# Altium project POWER_SUPPLY.PrjPcb (part 6 of 8)
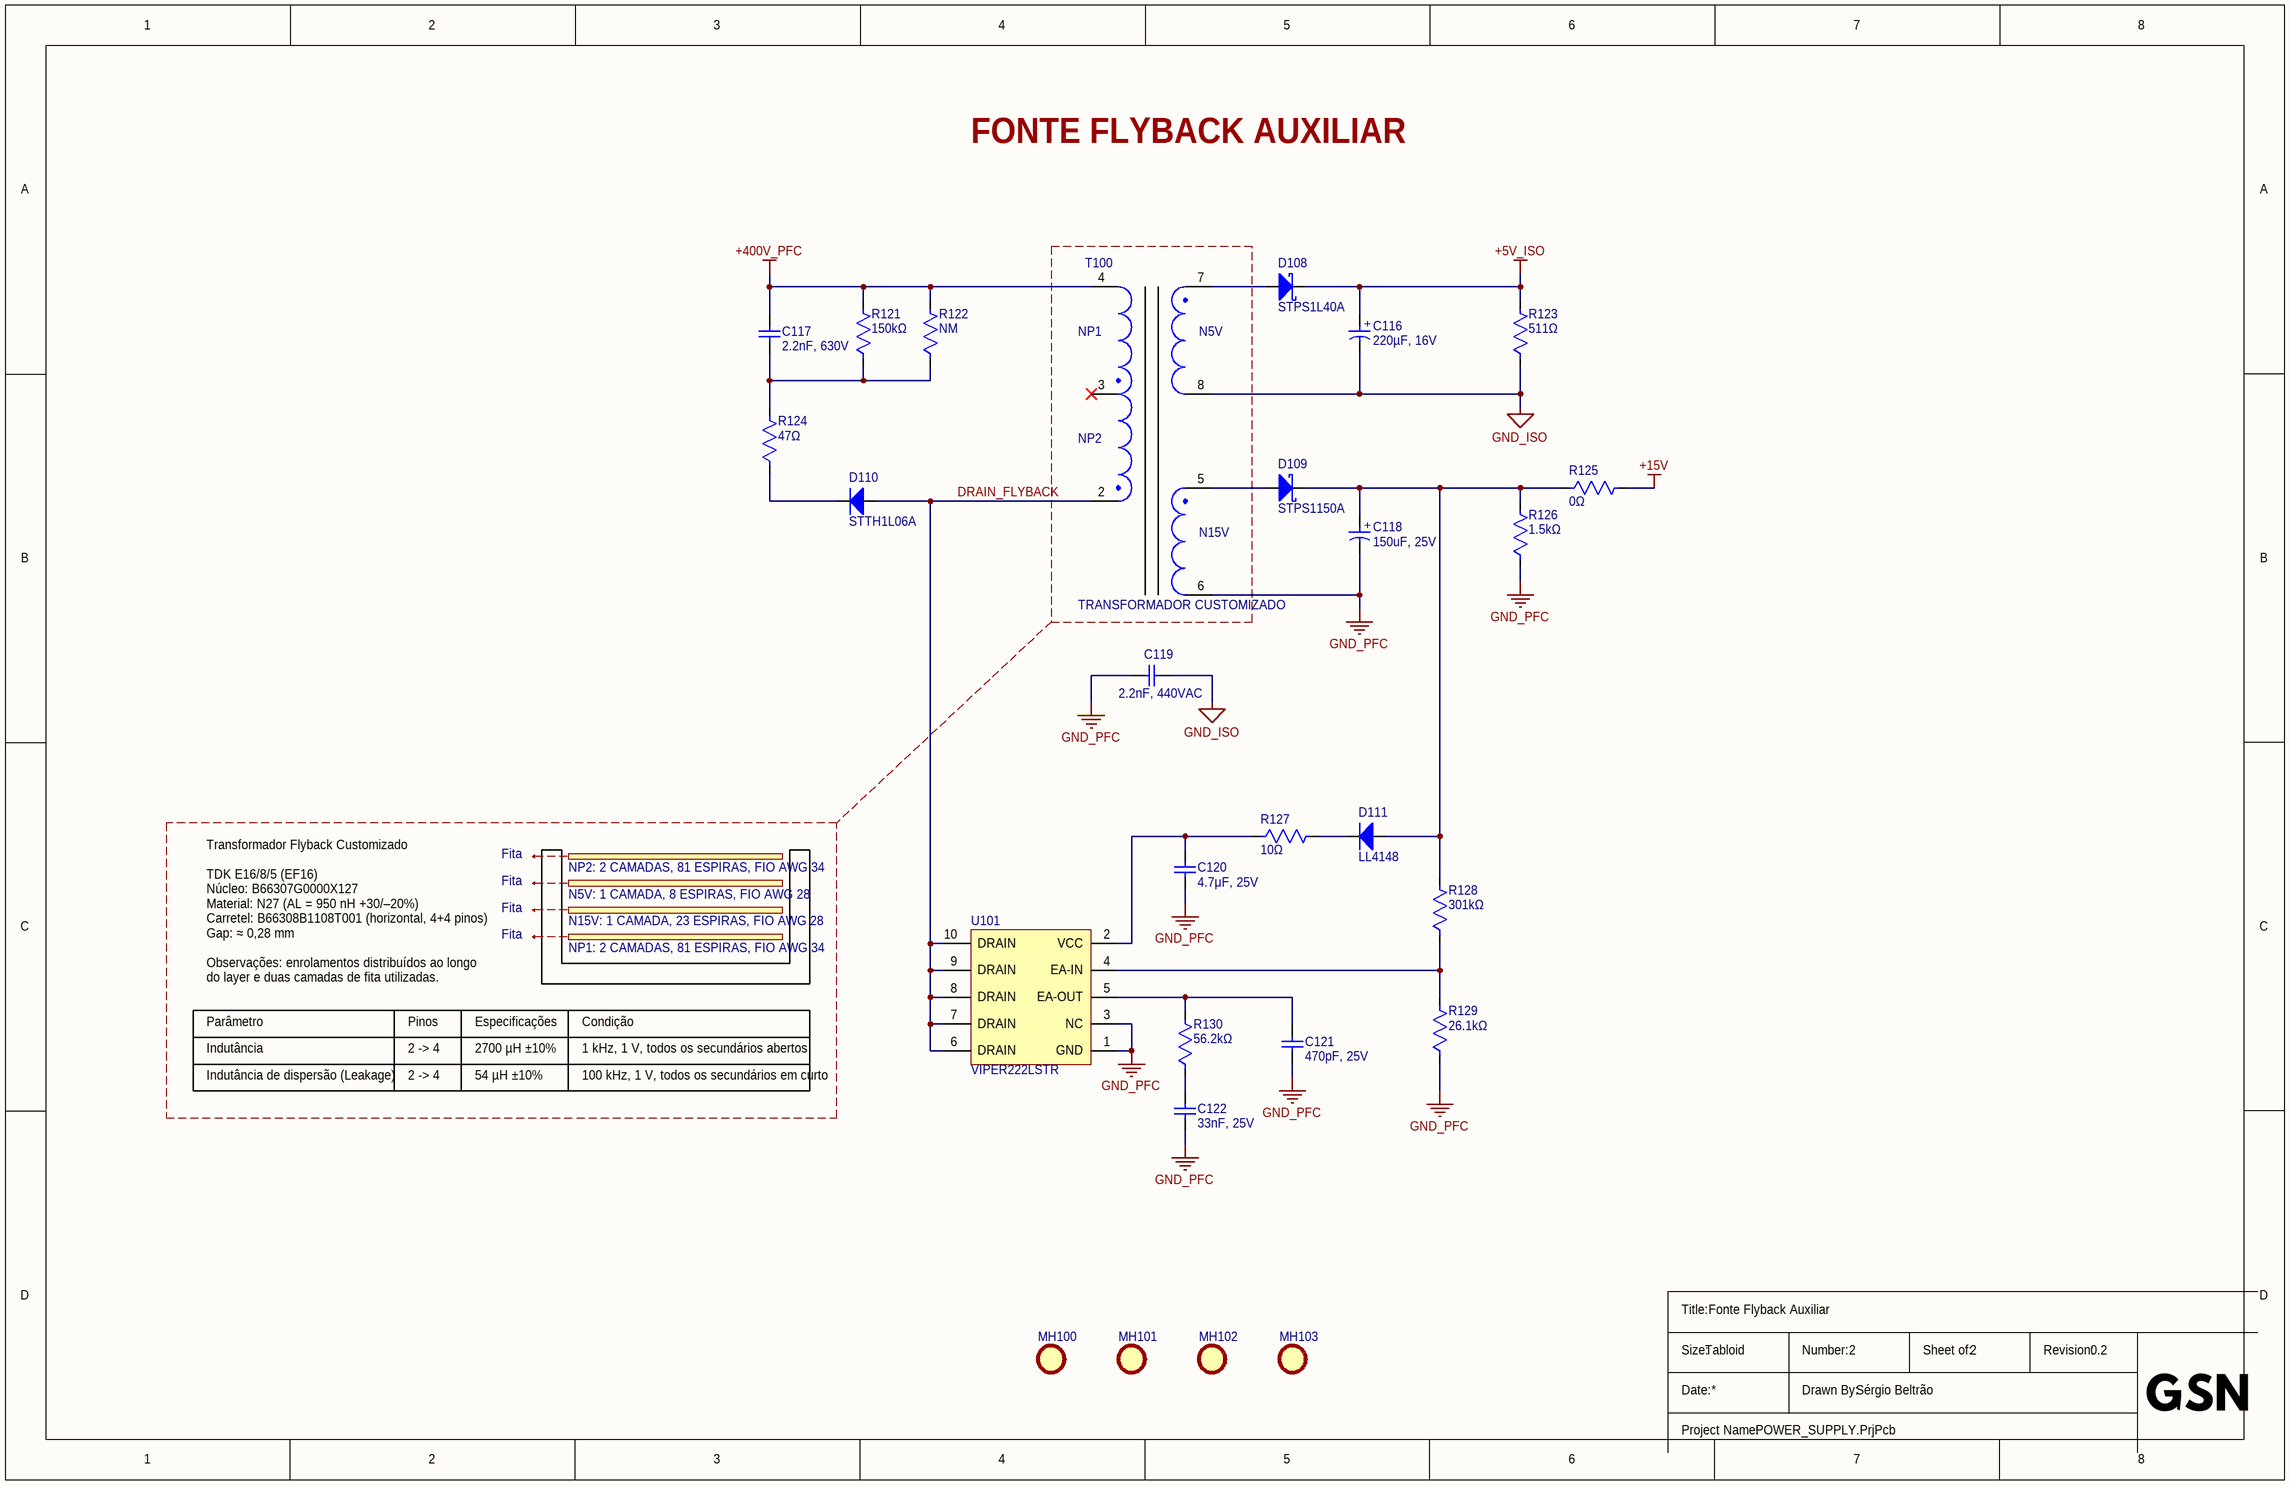
[diagram p7: 2_FLYBACK_AUXILIAR.SchDoc]

## Sheet 2_FLYBACK_AUXILIAR.SchDoc (continued)

### Library data of the parts (continued)
R126 = RC1206FR-071K5L: RES 1.5K OHM 1% 1/4W 1206; Manufacturer: Yageo Group; Max Power Dissipation: 250mW; Temperature Coefficient: 100ppm/°C; Voltage Rating: 200V; Supplier: DigiKey; Supplier Part Number: 311-1.50KFRCT-ND; Manufacturer Part Number: RC1206FR-071K5L; RoHS: Compliant; Category: Chip SMD Resistors; Stock: 90251; Pricing: 1=0.1, 10=0.047, 25=0.036, 50=0.0296, 100=0.0247, 250=0.0198, 500=0.01698, 1000=0.01477 (USD); Case/Package: 1206; Case Code (Imperial): 1206; Case Code (Metric): 3216; China RoHS: Non-Compliant; Composition: Thick Film; Depth: 1.6mm; Features: Moisture Resistant; Height: 550µm; Lead Free: Lead Free; Length: 3.1mm; Lifecycle Status: Production; Max Operating Temperature: 155°C; Military Standard: Not; Min Operating Temperature: -55°C; Mounting Technology: Surface Mount; Pins: 2; Number of Terminals: 2; Number of Terminations: 2; Packaging: Tape & Reel; Power Rating: 250mW; REACH SVHC: Yes; Value: 1.5kΩ; Schedule B: 8533210045, 8533210045|8533210045, 8533210045|8533210045|8533210045, 8533210045|8533210045|8533210045|8533210045; Termination: SMD/SMT; Tolerance: 1%; Voltage Rating (AC): 200V; Voltage Rating (DC): 200V; Width: 1.6mm; Working Voltage: 200V; ComponentLink1URL: https://datasheet.octopart.com:443/RC1206FR-071K5L-Yageo-datasheet-175887523.pdf?src-supplier=Newark; ComponentLink1Description: https://datasheet.octopart.com:443/RC1206FR-071K5L-Yageo-datasheet-175887523.pdf?src-supplier=Newark; ComponentLink2URL: https://datasheet.octopart.com:443/RC1206FR-071K5L-Yageo-datasheet-103092701.pdf?src-supplier=Upverter; ComponentLink2Description: https://datasheet.octopart.com:443/RC1206FR-071K5L-Yageo-datasheet-103092701.pdf?src-supplier=Upverter; ComponentLink3URL: https://datasheet.octopart.com:443/RC1206FR-071K5L-Yageo-datasheet-8359522.pdf?src-supplier=element14+APAC; ComponentLink3Description: https://datasheet.octopart.com:443/RC1206FR-071K5L-Yageo-datasheet-8359522.pdf?src-supplier=element14+APAC; ComponentLink4URL: https://datasheet.octopart.com:443/RC1206FR-071K5L-Yageo-Group-datasheet-190305687.pdf?src-supplier=Future+Electronics; ComponentLink4Description: https://datasheet.octopart.com:443/RC1206FR-071K5L-Yageo-Group-datasheet-190305687.pdf?src-supplier=Future+Electronics; ComponentLink5URL: https://datasheet.octopart.com:443/RC1206FR-071K5L-Yageo-datasheet-164759695.pdf?src-supplier=Future+Electronics; ComponentLink5Description: https://datasheet.octopart.com:443/RC1206FR-071K5L-Yageo-datasheet-164759695.pdf?src-supplier=Future+Electronics; ComponentLink6URL: https://datasheet.octopart.com:443/RC1206FR-071K5L-Yageo-datasheet-137700087.pdf?src-supplier=Future+Electronics; ComponentLink6Description: https://datasheet.octopart.com:443/RC1206FR-071K5L-Yageo-datasheet-137700087.pdf?src-supplier=Future+Electronics; ComponentLink7URL: https://datasheet.octopart.com:443/RC1206FR-071K5L-Yageo-datasheet-27233761.pdf?src-supplier=Future+Electronics; ComponentLink7Description: https://datasheet.octopart.com:443/RC1206FR-071K5L-Yageo-datasheet-27233761.pdf?src-supplier=Future+Electronics; ComponentLink8URL: https://datasheet.octopart.com:443/RC1206FR-071K5L-Yageo-datasheet-13032847.pdf?src-supplier=Future+Electronics; ComponentLink8Description: https://datasheet.octopart.com:443/RC1206FR-071K5L-Yageo-datasheet-13032847.pdf?src-supplier=Future+Electronics; ComponentLink9URL: https://datasheet.octopart.com:443/RC1206FR-071K5L-Yageo-datasheet-8324387.pdf?src-supplier=Future+Electronics; ComponentLink9Description: https://datasheet.octopart.com:443/RC1206FR-071K5L-Yageo-datasheet-8324387.pdf?src-supplier=Future+Electronics; ComponentLink10URL: https://datasheet.octopart.com:443/RC1206FR-071K5L-Yageo-datasheet-62067350.pdf?src-supplier=Farnell; ComponentLink10Description: https://datasheet.octopart.com:443/RC1206FR-071K5L-Yageo-datasheet-62067350.pdf?src-supplier=Farnell; ComponentLink11URL: https://datasheet.octopart.com:443/RC1206FR-071K5L-Yageo-datasheet-176638170.pdf?src-supplier=Farnell; ComponentLink11Description: https://datasheet.octopart.com:443/RC1206FR-071K5L-Yageo-datasheet-176638170.pdf?src-supplier=Farnell; ComponentLink12URL: https://datasheet.octopart.com:443/RC1206FR-071K5L-Yageo-datasheet-79472498.pdf?src-supplier=Megastar; ComponentLink12Description: https://datasheet.octopart.com:443/RC1206FR-071K5L-Yageo-datasheet-79472498.pdf?src-supplier=Megastar; ComponentLink13URL: https://datasheet.octopart.com/RC1206FR-071K5L-Yageo-datasheet-73766026.pdf; ComponentLink13Description: https://datasheet.octopart.com/RC1206FR-071K5L-Yageo-datasheet-73766026.pdf; ComponentLink14URL: https://datasheet.octopart.com:443/RC1206FR-071K5L-Yageo-datasheet-118639.pdf?src-supplier=DigiKey; ComponentLink14Description: https://datasheet.octopart.com:443/RC1206FR-071K5L-Yageo-datasheet-118639.pdf?src-supplier=DigiKey; ComponentLink15URL: http://sigma.octopart.com:80/conflict_mineral_statement/Yageo-company-3.pdf?src-supplier=Compliance+Statements; ComponentLink15Description: http://sigma.octopart.com:80/conflict_mineral_statement/Yageo-company-3.pdf?src-supplier=Compliance+Statements; ComponentLink16URL: http://sigma.octopart.com:80/rohs_statement/Yageo-company-2.pdf?src-supplier=Compliance+Statements; ComponentLink16Description: http://sigma.octopart.com:80/rohs_statement/Yageo-company-2.pdf?src-supplier=Compliance+Statements
R127 = RC0603FR-0710RL: RES 10 OHM 1% 1/10W 0603; Manufacturer: Yageo Group; Max Power Dissipation: 100mW; Temperature Coefficient: ±200ppm/°C; Voltage Rating (AC): 50V; Voltage Rating: 75V; Supplier Part Number: 311-10.0HRCT-ND; Manufacturer Part Number: RC0603FR-0710RL; Value: 10Ω; Case Code (Imperial): 0603; Case Code (Metric): 1608; Case/Package: 0603; Category: Chip SMD Resistors; China RoHS: Non-Compliant; Composition: Thick Film; Contact Plating: Tin; Depth: 800µm; Features: Moisture Resistant; Height: 450µm; Lead Free: Lead Free; Length: 1.6mm; Lifecycle Status: Production; Max Operating Temperature: 155°C; Military Standard: Not; Min Operating Temperature: -55°C; Mounting Technology: Surface Mount; Number of Terminals: 2; Number of Terminations: 2; Packaging: Tape & Reel; Power Dissipation: 100mW; Power Rating: 100mW; Radiation Hardening: No; REACH SVHC: Yes; RoHS: Compliant; Supplier: DigiKey; Termination: SMD/SMT; Tolerance: 1%; Component Link Description: https://www.yageogroup.com/content/datasheet/asset/file/PYU-RC_GROUP_51_ROHS_L; Component Link URL: https://www.yageogroup.com/content/datasheet/asset/file/PYU-RC_GROUP_51_ROHS_L; Datasheet: https://www.yageogroup.com/content/datasheet/asset/file/PYU-RC_GROUP_51_ROHS_L; Voltage Rating (DC): 50V; Weight: 2.012816mg; Width: 800µm; Working Voltage: 75V
R128 = RC0603FR-07301KL: RES 301K OHM 1% 1/10W 0603; Manufacturer: Yageo Group; Max Power Dissipation: 100mW; Temperature Coefficient: ±200ppm/°C; Voltage Rating (AC): 50V; Voltage Rating: 75V; Supplier Part Number: 311-301KHRCT-ND; Manufacturer Part Number: RC0603FR-07301KL; Value: 301kΩ; Case Code (Imperial): 0603; Case Code (Metric): 1608; Case/Package: 0603; Category: Chip SMD Resistors; China RoHS: Non-Compliant; Composition: Thick Film; Contact Plating: Tin; Depth: 800µm; Features: Moisture Resistant; Height: 450µm; Lead Free: Lead Free; Length: 1.6mm; Lifecycle Status: Production; Max Operating Temperature: 155°C; Military Standard: Not; Min Operating Temperature: -55°C; Mounting Technology: Surface Mount; Number of Terminals: 2; Number of Terminations: 2; Packaging: Tape & Reel; Power Dissipation: 100mW; Power Rating: 100mW; Radiation Hardening: No; REACH SVHC: Yes; RoHS: Compliant; Supplier: DigiKey; Termination: SMD/SMT; Tolerance: 1%; Component Link Description: https://www.yageogroup.com/content/datasheet/asset/file/PYU-RC_GROUP_51_ROHS_L; Component Link URL: https://www.yageogroup.com/content/datasheet/asset/file/PYU-RC_GROUP_51_ROHS_L; Datasheet: https://www.yageogroup.com/content/datasheet/asset/file/PYU-RC_GROUP_51_ROHS_L; Voltage Rating (DC): 50V; Weight: 2.012816mg; Width: 800µm; Working Voltage: 75V
R129 = RC0603FR-0726K1L: RES 26.1K OHM 1% 1/10W 0603; Manufacturer: Yageo Group; Max Power Dissipation: 100mW; Temperature Coefficient: ±200ppm/°C; Voltage Rating (AC): 50V; Voltage Rating: 75V; Supplier Part Number: 311-26.1KHRCT-ND; Manufacturer Part Number: RC0603FR-0726K1L; Value: 26.1kΩ; Case Code (Imperial): 0603; Case Code (Metric): 1608; Case/Package: 0603; Category: Chip SMD Resistors; China RoHS: Non-Compliant; Composition: Thick Film; Contact Plating: Tin; Depth: 800µm; Features: Moisture Resistant; Height: 450µm; Lead Free: Lead Free; Length: 1.6mm; Lifecycle Status: Production; Max Operating Temperature: 155°C; Military Standard: Not; Min Operating Temperature: -55°C; Mounting Technology: Surface Mount; Number of Terminals: 2; Number of Terminations: 2; Packaging: Tape & Reel; Power Dissipation: 100mW; Power Rating: 100mW; Radiation Hardening: No; REACH SVHC: Yes; RoHS: Compliant; Supplier: DigiKey; Termination: SMD/SMT; Tolerance: 1%; Component Link Description: https://www.yageogroup.com/content/datasheet/asset/file/PYU-RC_GROUP_51_ROHS_L; Component Link URL: https://www.yageogroup.com/content/datasheet/asset/file/PYU-RC_GROUP_51_ROHS_L; Datasheet: https://www.yageogroup.com/content/datasheet/asset/file/PYU-RC_GROUP_51_ROHS_L; Voltage Rating (DC): 50V; Weight: 2.012816mg; Width: 800µm; Working Voltage: 75V
R130 = RC0603FR-0756K2L: RES 56.2K OHM 1% 1/10W 0603; Manufacturer: Yageo Group; Max Power Dissipation: 100mW; Temperature Coefficient: ±200ppm/°C; Voltage Rating (AC): 50V; Voltage Rating: 75V; Supplier Part Number: 311-56.2KHRCT-ND; Manufacturer Part Number: RC0603FR-0756K2L; Value: 56.2kΩ; Case Code (Imperial): 0603; Case Code (Metric): 1608; Case/Package: 0603; Category: Chip SMD Resistors; China RoHS: Non-Compliant; Composition: Thick Film; Contact Plating: Tin; Depth: 800µm; Features: Moisture Resistant; Height: 450µm; Lead Free: Lead Free; Length: 1.6mm; Lifecycle Status: Production; Max Operating Temperature: 155°C; Military Standard: Not; Min Operating Temperature: -55°C; Mounting Technology: Surface Mount; Number of Terminals: 2; Number of Terminations: 2; Packaging: Tape & Reel; Power Dissipation: 100mW; Power Rating: 100mW; Radiation Hardening: No; REACH SVHC: Yes; RoHS: Compliant; Supplier: DigiKey; Termination: SMD/SMT; Tolerance: 1%; Component Link Description: https://www.yageogroup.com/content/datasheet/asset/file/PYU-RC_GROUP_51_ROHS_L; Component Link URL: https://www.yageogroup.com/content/datasheet/asset/file/PYU-RC_GROUP_51_ROHS_L; Datasheet: https://www.yageogroup.com/content/datasheet/asset/file/PYU-RC_GROUP_51_ROHS_L; Voltage Rating (DC): 50V; Weight: 2.012816mg; Width: 800µm; Working Voltage: 75V
T100 = CUSTOM_FLYBACK_TCC: TRANSFORMADOR FLYBACK CUSTOMIZADO QUE USEI NO TCC; Manufacturer Part Number: Custom; ComponentLink1Description: Datasheet; ComponentLink1URL: https://www.tdk-electronics.tdk.com/inf/80/db/fer/e_16_8_5.pdf; Manufacturer: Custom
U101 = VIPER222LSTR: IC OFFLINE SWITCH FLYBACK 10SSOP; Manufacturer: STMicroelectronics; Continuous Drain Current (ID): 620mA; Max Supply Voltage: 30V; Max Supply Current: 1.6mA; Max Switching Frequency: 66kHz; Min Breakdown Voltage: 730V; Min Input Voltage: 4.5V; Nominal Supply Voltage: 9V; Number of Circuits: 1; Rds On Max: 15Ω; Topology: Buck-Boost; Supplier: DigiKey; Supplier Part Number: 497-VIPER222LSCT-ND; Manufacturer Part Number: VIPER222LSTR; RoHS: Compliant; Category: AC-DC Converters; Stock: 81; Pricing: 1=0.99, 10=0.709, 25=0.6392, 100=0.5628, 250=0.52628, 500=0.5043, 1000=0.48945 (USD); Case/Package: SSOP; China RoHS: Compliant; Country of Origin: Mainland China; Export Control Classification Number (ECCN) Code: EAR99; Height - Seated (Max): 1.75mm; Harmonized Tariff Schedule (HTS) Code: 8542.39.00.60; Introduction Date: 2020-01-22; Length: 4.9mm; Lifecycle Status: Production; Max Operating Temperature: 150°C; Min Operating Temperature: -40°C; Number of Terminals: 10; Packaging: Tape and Reel; REACH SVHC: Yes; Schedule B: 8542390000, 8542390000|8542390000, 8542390000|8542390000|8542390000, 8542390000|8542390000|8542390000|8542390000; Terminal Pitch: 1mm; Width: 3.9mm

## Sheet 3_LLC.SchDoc
size Tabloid; SheetNumber: 3; SheetTotal: 3; SPICEModelCacheDMZTLHAU: <root> / <DocumentId>DMZTLHAU</DocumentId> / <CacheFrame Number="0"> / <Model Name="0603_885012206095r_100nf" Kind="CKT"> / <Text>******* / .subckt 0603_885012206095R_100nF 1 2 / Rser 1 3 0.0157659152881 / Lser 2 4 3.10171966E-10 / C1 3 4 0.0000001 / Rpar 3 4 5000000000 / .ends 0603_885012206095R_100nF</Text> / </Model> / <Model Name="0603_885012206126_1uf" Kind="CKT"> / <Text>******* / .subckt 0603_885012206126_1uF 1 2 / Rser 1 3 0.0115 / Lser 2 4 0.0000000008 / C1 3 4 0.000001 / Rpar 3 4 500000000 / .ends 0603_885012206126_1uF</Text> / </Model> / <Model Name="0603_885012206089_10nf" Kind="CKT"> / <Text>******* / .subckt 0603_885012206089_10nF 1 2 / Rser 1 3 0.0358532866879 / Lser 2 4 3.4059544E-10 / C1 3 4 0.00000001 / Rpar 3 4 10000000000 / .ends 0603_885012206089_10nF</Text> / </Model> / <Model Name="1206_885342008002_220pf" Kind="CKT"> / <Text>******* / .subckt 1206_885342008002_220pF 1 2 / Rser 1 3 0.0989171163333 / Lser 2 4 4.16981088E-10 / C1 3 4 0.00000000022 / Rpar 3 4 10000000000 / .ends 1206_885342008002_220pF</Text> / </Model> / <Model Name="0805_885012207092_10nf" Kind="CKT"> / <Text>******* / .subckt 0805_885012207092_10nF 1 2 / Rser 1 3 0.06275 / Lser 2 4 0.00000000031024 / C1 3 4 0.00000001 / Rpar 3 4 10000000000 / .ends 0805_885012207092_10nF</Text> / </Model> / <Model Name="0603_885012006059_220pf" Kind="CKT"> / <Text>******* / .subckt 0603_885012006059_220pF 1 2 / Rser 1 3 0.120673949599 / Lser 2 4 6.11171216E-10 / C1 3 4 0.00000000022 / Rpar 3 4 10000000000 / .ends 0603_885012006059_220pF</Text> / </Model> / <Model Name="0603_885012006061_470pf" Kind="CKT"> / <Text>******* / .subckt 0603_885012006061_470pF 1 2 / Rser 1 3 0.0701665420081 / Lser 2 4 5.55279727E-10 / C1 3 4 0.00000000047 / Rpar 3 4 10000000000 / .ends 0603_885012006061_470pF</Text> / </Model> / <Model Name="1210_885342009004_10pf" Kind="CKT"> / <Text>******* / .subckt 1210_885342009004_10pF 1 2 / Rser 1 3 0.259686916806 / Lser 2 4 3.16360399E-10 / C1 3 4 0.00000000001 / Rpar 3 4 10000000000 / .ends 1210_885342009004_10pF</Text> / </Model> / <Model Name="0603_885012206121_330nf" Kind="CKT"> / <Text>******* / .subckt 0603_885012206121_330nF 1 2 / Rser 1 3 0.0116331902783 / Lser 2 4 2.98906197E-10 / C1 3 4 0.00000033 / Rpar 3 4 1500000000 / .ends 0603_885012206121_330nF</Text> / </Model> / <Model Name="0603_885012206075_470nf" Kind="CKT"> / <Text>******* / .subckt 0603_885012206075_470nF 1 2 / Rser 1 3 0.0100816359349 / Lser 2 4 4.14055319E-10 / C1 3 4 0.00000047 / Rpar 3 4 1100000000 / .ends 0603_885012206075_470nF</Text> / </Model> / </CacheFrame> / </root>
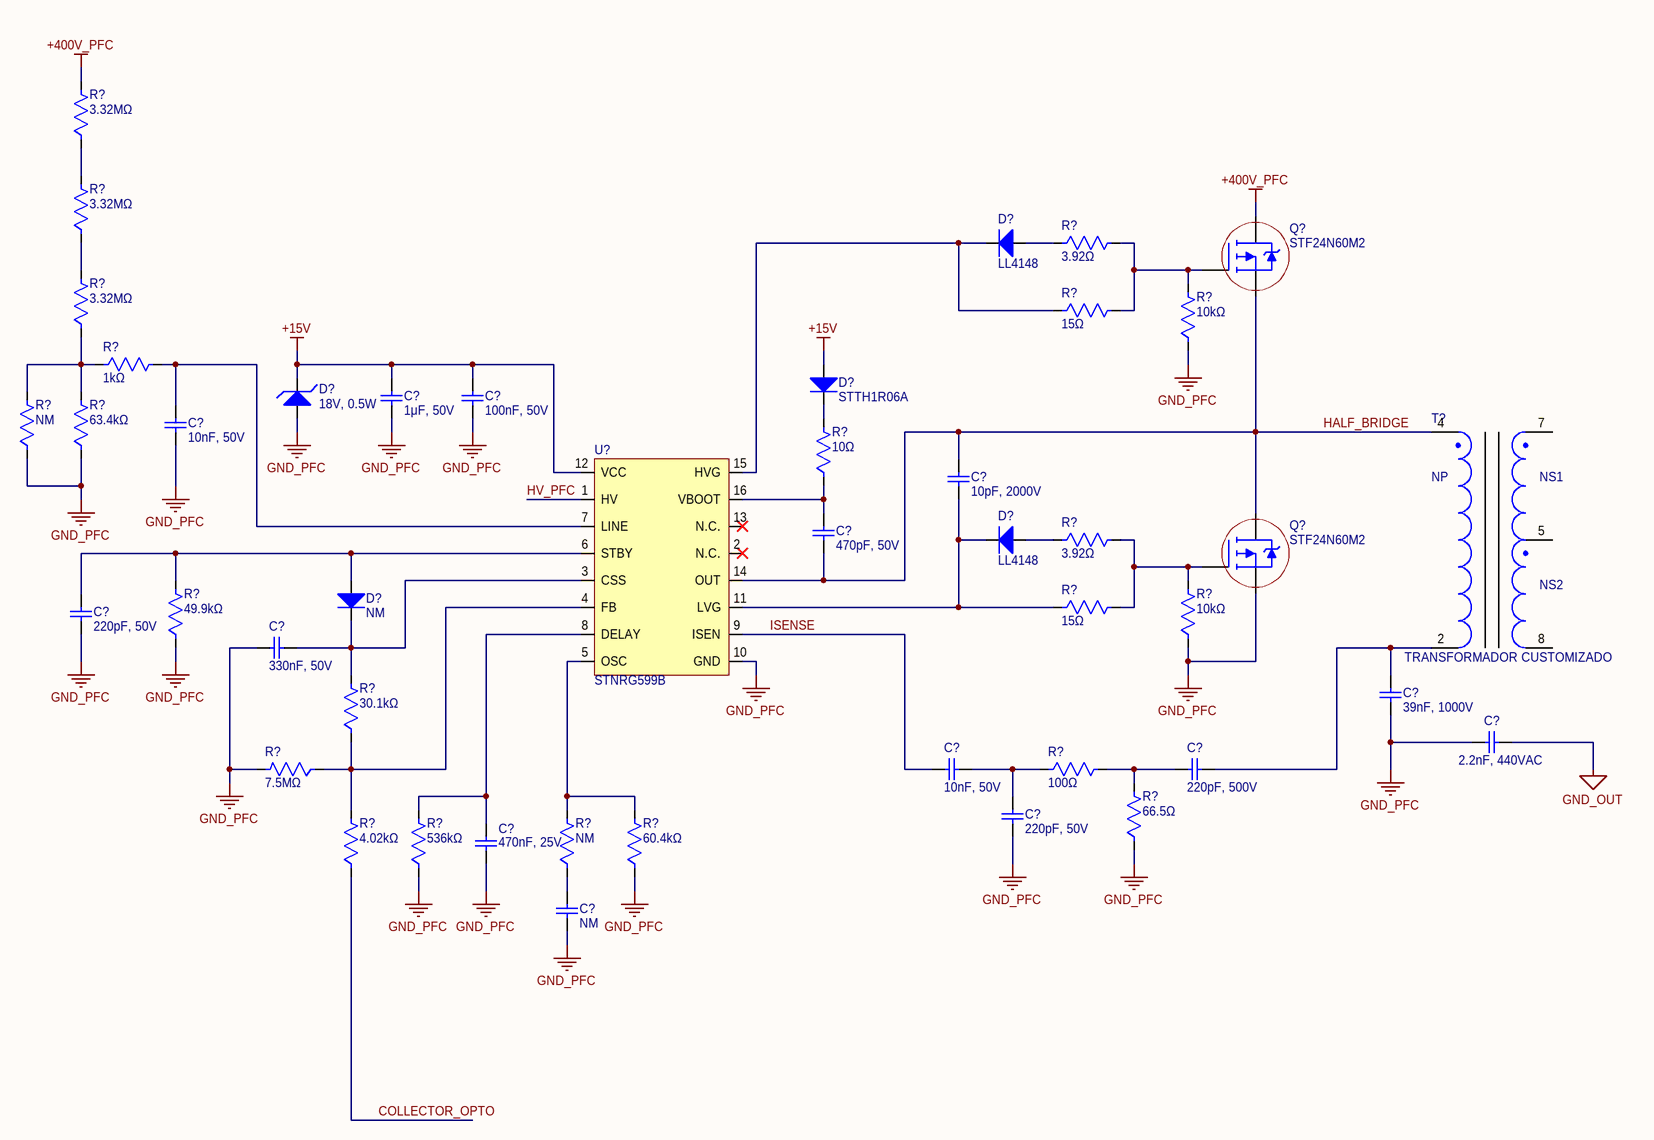
[diagram p2: 3_LLC.SchDoc]

### Parts
(Parts that share a designator on the sheet are numbered #1, #2 ... from top to bottom, then left to right.)
C?#1  1μF, 50V  [WCAP-CSGP_0603_L1.6W0.8H0.8_Wave]
C?#2  100nF, 50V  [WCAP-CSGP_0603_L1.6W0.8H0.8_Wave]
C?#3  10nF, 50V  [WCAP-CSGP_0603_L1.6W0.8H0.8_Reflow]
C?#4  10pF, 2000V  [WCAP-CSMH_1210_H0.95]
C?#5  470pF, 50V  [WCAP-CSGP_0603_L1.6W0.8H0.8_Reflow]
C?#6  220pF, 50V  [WCAP-CSGP_0603_L1.6W0.8H0.8_Reflow]
C?#7  330nF, 50V  [WCAP-CSGP_0603_L1.6W0.8H0.8_Reflow]
C?#8  39nF, 1000V  [R76QI2390SE40J]
C?#9  2.2nF, 440VAC  [CAP_5US63V7_VIS]
C?#10  10nF, 50V  [WCAP-CSGP_0805_L2W1.25H0.8_Reflow]
C?#11  220pF, 500V  [WCAP-CSMH_1206_H0.8_Reflow]
C?#12  220pF, 50V  [WCAP-CSGP_0603_L1.6W0.8H0.8_Reflow]
C?#13  470nF, 25V  [WCAP-CSGP_0603_L1.6W0.8H0.8_Reflow]
C?#14  NM  [WCAP-CSGP_0603_L1.6W0.8H0.8_Wave]
D?#1  LL4148  [SOD-80-DIODE]
D?#2  STTH1R06A  [SMA]
D?#3  18V, 0.5W  [SOD-80-DIODE]
D?#4  LL4148  [SOD-80-DIODE]
D?#5  NM  [SOD-80-DIODE]
Q?#1  STF24N60M2  [TO-220FP]
Q?#2  STF24N60M2  [TO-220FP]
R?#1  3.32MΩ  [1206-REFLOW]
R?#2  3.32MΩ  [1206-REFLOW]
R?#3  3.92Ω  [0805-WAVE]
R?#4  15Ω  [0805-WAVE]
R?#5  3.32MΩ  [1206-REFLOW]
R?#6  10kΩ  [0805-WAVE]
R?#7  1kΩ  [0805-REFLOW]
R?#8  NM  [0805-REFLOW]
R?#9  63.4kΩ  [0805-REFLOW]
R?#10  10Ω  [0805-REFLOW]
R?#11  3.92Ω  [0805-WAVE]
R?#12  15Ω  [0805-WAVE]
R?#13  49.9kΩ  [0603-REFLOW]
R?#14  10kΩ  [0805-WAVE]
R?#15  30.1kΩ  [0603-REFLOW]
R?#16  7.5MΩ  [0603-REFLOW]
R?#17  100Ω  [0805-REFLOW]
R?#18  66.5Ω  [0805-REFLOW]
R?#19  4.02kΩ  [0603-REFLOW]
R?#20  536kΩ  [0603-REFLOW]
R?#21  NM  [0603-REFLOW]
R?#22  60.4kΩ  [0603-REFLOW]
T?  TRANSFORMADOR CUSTOMIZADO
U?  STNRG599B  [16-SOIC_3MM90W]

### Nets
+15V: C?#1.2 C?#2.2 D?#2.2(A) D?#3.1(K) U?.12(VCC)
+400V_PFC: Q?#1.2(DRAIN) R?#1.2
GND_OUT: C?#9.2
GND_PFC: C?#1.1 C?#2.1 C?#3.1 C?#6.1 C?#7.2 C?#8.1 C?#9.1 C?#12.1 C?#13.1 C?#14.1 D?#3.2(A) Q?#2.3(SOURCE) R?#6.1 R?#8.1 R?#9.1 R?#13.1 R?#14.1 R?#16.2 R?#18.1 R?#20.1 R?#22.1 U?.10(GND)
COLLECTOR_OPTO: R?#19.1
HALF_BRIDGE: C?#4.2 C?#5.1 Q?#1.3(SOURCE) Q?#2.2(DRAIN) T?.4 U?.14(OUT)
HV_PFC: U?.1(HV)
ISENSE: C?#10.1 U?.9(ISEN)
NetC?#3_2: C?#3.2 R?#7.2 U?.7(LINE)
NetC?#4_1: C?#4.1 D?#4.1(K) R?#12.1 U?.11(LVG)
NetC?#5_2: C?#5.2 R?#10.1 U?.16(VBOOT)
NetC?#6_2: C?#6.2 D?#5.2(A) R?#13.2 U?.6(STBY)
NetC?#7_1: C?#7.1 D?#5.1(K) R?#15.2 U?.3(CSS)
NetC?#8_2: C?#8.2 C?#11.2 T?.2
NetC?#10_2: C?#10.2 C?#12.2 R?#17.1
NetC?#11_1: C?#11.1 R?#17.2 R?#18.2
NetC?#13_2: C?#13.2 R?#20.2 U?.8(DELAY)
NetC?#14_2: C?#14.2 R?#21.1
NetD?#1_1: D?#1.1(K) R?#4.1 U?.15(HVG)
NetD?#1_2: D?#1.2(A) R?#3.1
NetD?#2_1: D?#2.1(K) R?#10.2
NetD?#4_2: D?#4.2(A) R?#11.1
NetQ?#1_1: Q?#1.1(GATE) R?#3.2 R?#4.2 R?#6.2
NetQ?#2_1: Q?#2.1(GATE) R?#11.2 R?#12.2 R?#14.2
NetR?#1_1: R?#1.1 R?#2.2
NetR?#2_1: R?#2.1 R?#5.2
NetR?#5_1: R?#5.1 R?#7.1 R?#8.2 R?#9.2
NetR?#15_1: R?#15.1 R?#16.1 R?#19.2 U?.4(FB)
NetR?#21_2: R?#21.2 R?#22.2 U?.5(OSC)

Not connected (* = marked no-connect by the designer): T? 5 7 8; U? 2(N.C.)* 13(N.C.)*

### Notes on the sheet
- Title:
- Size:
- Tabloid
- Number:
- Sheet of:
- Revision:
- Date:
- Project Name:
- Drawn By:
- (in symbol CUSTOM_LLC_TCC) NP; NS1; NS2